# Altium schematic sheet MainBoard.SchDoc
size A4
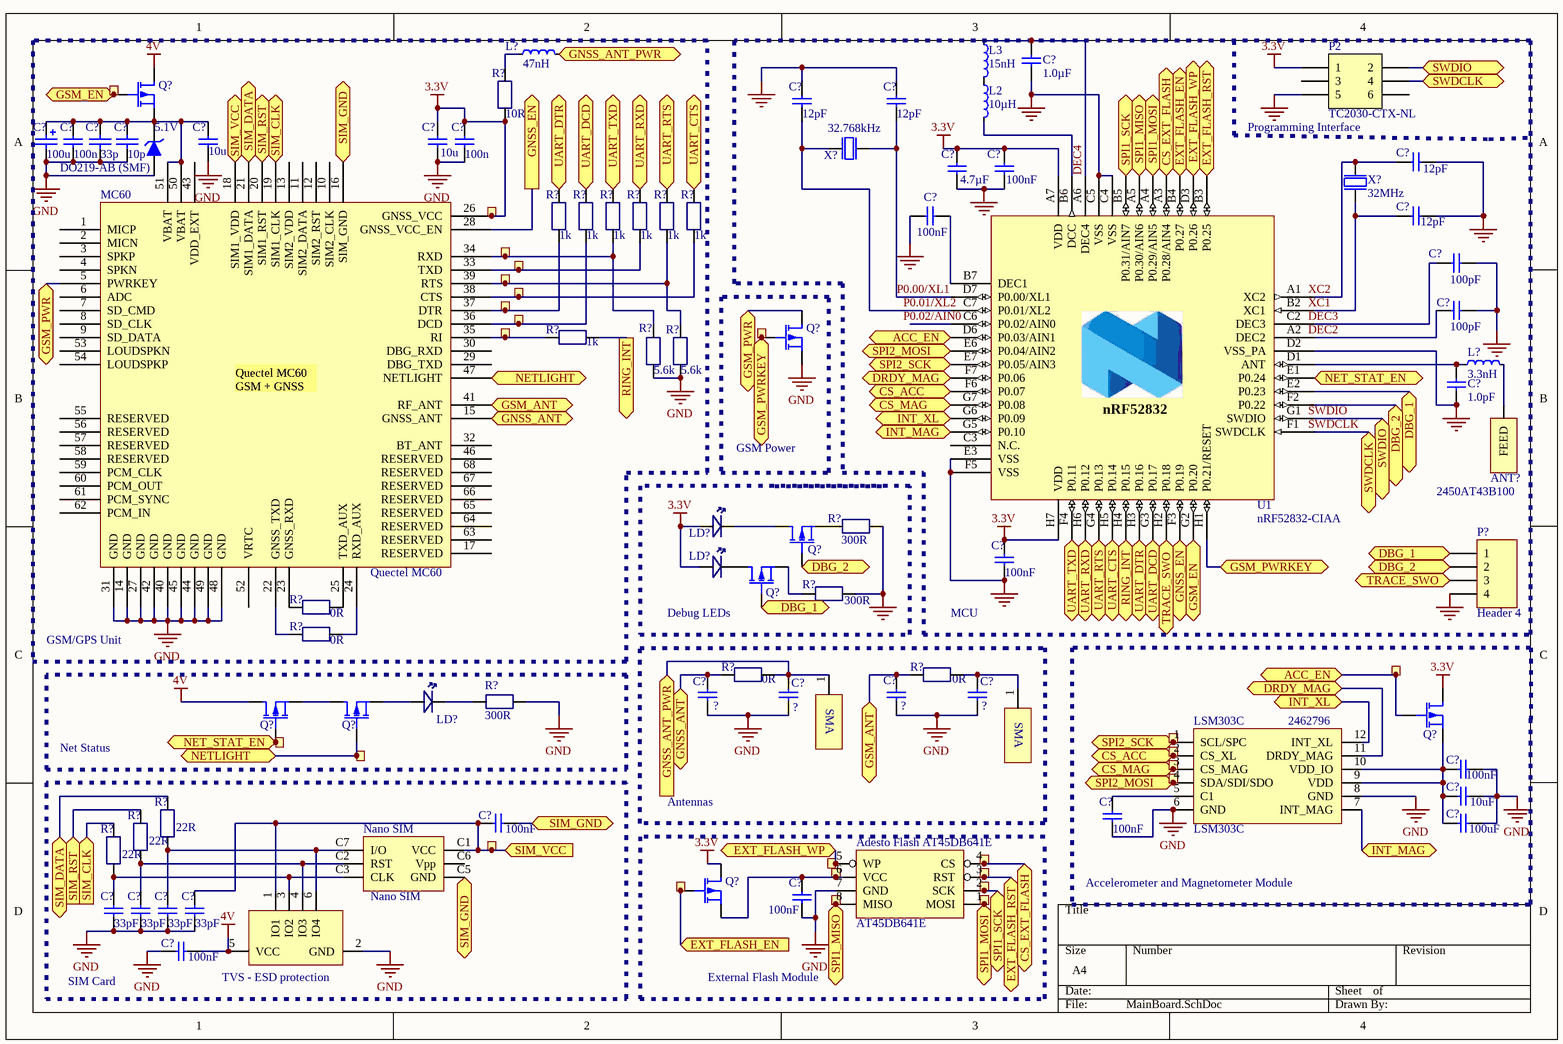
[diagram p0: MainBoard.SchDoc]

## Parts
(Parts that share a designator on the sheet are numbered #1, #2 ... from top to bottom, then left to right.)
5.1V  DO219-AB (SMF)  [DO219-AB]
?#1  Ø1.0mm,SMD  [TP_SMD_Ř1.0mm]  (value not drawn)  (no BOM)
?#2  Ø1.0mm,SMD  [TP_SMD_Ř1.0mm]  (value not drawn)  (no BOM)
?#3  Ø1.0mm,SMD  [TP_SMD_Ř1.0mm]  (value not drawn)  (no BOM)
?#4  Ø1.0mm,SMD  [TP_SMD_Ř1.0mm]  (value not drawn)  (no BOM)
?#5  Ø1.0mm,SMD  [TP_SMD_Ř1.0mm]  (value not drawn)  (no BOM)
?#6  Ø1.0mm,SMD  [TP_SMD_Ř1.0mm]  (value not drawn)  (no BOM)
?#7  Ø1.0mm,SMD  [TP_SMD_Ř1.0mm]  (value not drawn)  (no BOM)
?#8  Ø1.0mm,SMD  [TP_SMD_Ř1.0mm]  (value not drawn)  (no BOM)
?#9  Ø1.0mm,SMD  [TP_SMD_Ř1.0mm]  (value not drawn)  (no BOM)
?#10  Ø1.0mm,SMD  [TP_SMD_Ř1.0mm]  (value not drawn)  (no BOM)
?#11  Ø1.0mm,SMD  [TP_SMD_Ř1.0mm]  (value not drawn)  (no BOM)
?#12  Ø1.0mm,SMD  [TP_SMD_Ř1.0mm]  (value not drawn)  (no BOM)
?#13  Ø1.0mm,SMD  [TP_SMD_Ř1.0mm]  (value not drawn)  (no BOM)
?#14  Ø1.0mm,SMD  [TP_SMD_Ř1.0mm]  (value not drawn)  (no BOM)
?#15  Ø1.0mm,SMD  [TP_SMD_Ř1.0mm]  (value not drawn)  (no BOM)
?#16  Ø1.0mm,SMD  [TP_SMD_Ř1.0mm]  (value not drawn)  (no BOM)
?#17  Ø1.0mm,SMD  [TP_SMD_Ř1.0mm]  (value not drawn)  (no BOM)
?#18  Ø1.0mm,SMD  [TP_SMD_Ř1.0mm]  (value not drawn)  (no BOM)
?#19  Ø1.0mm,SMD  [TP_SMD_Ř1.0mm]  (value not drawn)  (no BOM)
?#20  Ø1.0mm,SMD  [TP_SMD_Ř1.0mm]  (value not drawn)  (no BOM)
?#21  Ø1.0mm,SMD  [TP_SMD_Ř1.0mm]  (value not drawn)  (no BOM)
?#22  Ø1.0mm,SMD  [TP_SMD_Ř1.0mm]  (value not drawn)  (no BOM)
?#23  Ø1.0mm,SMD  [TP_SMD_Ř1.0mm]  (value not drawn)  (no BOM)
?#24  Ø1.0mm,SMD  [TP_SMD_Ř1.0mm]  (value not drawn)  (no BOM)
?#25  Ø1.0mm,SMD  [TP_SMD_Ř1.0mm]  (value not drawn)  (no BOM)
?#26  Ø1.0mm,SMD  [TP_SMD_Ř1.0mm]  (value not drawn)  (no BOM)
?#27  TVS - ESD protection  [SO-G6/P.95]
Adesto_Flash_AT45DB641E  AT45DB641E  [UDFN 5x6mm 8pin]
ANT?  2450AT43B100  [2450AT43B100]
C?#1  1.0µF  [CAPC1005X04L]
C?#2  10u  [CAPC1608X06L]
C?#3  10u  [CAPC1608X06L]
C?#4  12pF  [CAPC0603X03L]
C?#5  12pF  [CAPC0603X03L]
C?#6  value 100u  [B]
C?#7  value 33p  [1608[0603]]
C?#8  value 10p  [1608[0603]]
C?#9  4.7µF  [CAPC1608X06L]
C?#10  100n  [CAPC1005X04L]
C?#11  100n  [CAPC1005X04L]
C?#12  12pF  [CAPC0603X03L]
C?#13  100nF  [CAPC1005X04L]
C?#14  100nF  [CAPC1005X04L]
C?#15  12pF  [CAPC0603X03L]
C?#16  100pF  [CAPC0603X03L]
C?#17  100pF  [CAPC0603X03L]
C?#18  1.0pF  [CAPC0603X03L]
C?#19  100nF  [CAPC1005X04L]
C?#20  ?  [CAPC1005X04L]
C?#21  ?  [CAPC1005X04L]
C?#22  ?  [CAPC1005X04L]
C?#23  ?  [CAPC1005X04L]
C?#24  100nF  [CAPC1005X04L]
C?#25  10uF  [CAPC1005X04L]
C?#26  100nF  [CAPC1005X04L]
C?#27  100uF  [CAPC1005X04L]
C?#28  100nF  [CAPC1005X04L]
C?#29  33pF  [CAPC1005X04L]
C?#30  33pF  [CAPC1005X04L]
C?#31  33pF  [CAPC1005X04L]
C?#32  100nF  [CAPC1005X04L]
C?#33  33pF  [CAPC1005X04L]
C?#34  100nF  [CAPC1005X04L]
L2  10µH  [INDC1608X06L]
L3  15nH  [INDC1005X04L]
L?#1  47nH  [INDC1005X04L]
L?#2  3.3nH  [INDC0603X03L]
LD?#1  0603_LED  [LED_0603]  (value not drawn)
LD?#2  0603_LED  [LED_0603]  (value not drawn)
LD?#3  0603_LED  [LED_0603]  (value not drawn)
LSM303C  LSM303C  Supplier Part Number 1: 2462796  [LGA-12]
MC60  Quectel MC60  [Quactel MC60 Footprint]
Nano_SIM  Nano SIM  [NANO_Sim_Holder]
P2  TC2030-CTX-NL  [TC2030-IDC-NLFP]  (no BOM)
P?  Header 4  [HDR1X4]
Q?#1  RZE002P02TLTR-ND  [SOT-416]  (value not drawn)
Q?#2  RZE002P02TLTR-ND  [SOT-416]  (value not drawn)
Q?#3  RZE002P02TLTR-ND  [SOT-416]  (value not drawn)
Q?#4  RZE002P02TLTR-ND  [SOT-416]  (value not drawn)
Q?#5  RZE002P02TLTR-ND  [SOT-416]  (value not drawn)
Q?#6  RZE002P02TLTR-ND  [SOT-416]  (value not drawn)
Q?#7  RZE002P02TLTR-ND  [SOT-416]  (value not drawn)
Q?#8  RZE002P02TLTR-ND  [SOT-416]  (value not drawn)
R?#1  value 10R  [RES_0402]  (hidden comment: RES_0402_1k)
R?#2  value 1k  [RES_0402]  (hidden comment: RES_0402_1k)
R?#3  value 1k  [RES_0402]  (hidden comment: RES_0402_1k)
R?#4  value 1k  [RES_0402]  (hidden comment: RES_0402_1k)
R?#5  value 1k  [RES_0402]  (hidden comment: RES_0402_1k)
R?#6  value 1k  [RES_0402]  (hidden comment: RES_0402_1k)
R?#7  value 1k  [RES_0402]  (hidden comment: RES_0402_1k)
R?#8  value 1k  [RES_0402]  (hidden comment: RES_0402_1k)
R?#9  value 5.6k  [RES_0402]  (hidden comment: RES_0402_1k)
R?#10  value 5.6k  [RES_0402]  (hidden comment: RES_0402_1k)
R?#11  value 300R  [RES_0402]  (hidden comment: RES_0402_1k)
R?#12  value 300R  [RES_0402]  (hidden comment: RES_0402_1k)
R?#13  value 0R  [RES_0402]  (hidden comment: RES_0402_1k)
R?#14  value 0R  [RES_0402]  (hidden comment: RES_0402_1k)
R?#15  value 0R  [RES_0402]  (hidden comment: RES_0402_1k)
R?#16  value 0R  [RES_0402]  (hidden comment: RES_0402_1k)
R?#17  value 300R  [RES_0402]  (hidden comment: RES_0402_1k)
R?#18  value 22R  [RES_0402]  (hidden comment: RES_0402_1k)
R?#19  value 22R  [RES_0402]  (hidden comment: RES_0402_1k)
R?#20  value 22R  [RES_0402]  (hidden comment: RES_0402_1k)
SMA_connector#1  GNSS_SMA  [SMA_Footprint]  (value not drawn)
SMA_connector#2  GSM_SMA  [SMA_Footprint]  (value not drawn)
U1  nRF52832-CIAA  [BGA50C40P7X8_295X322X50]
X?#1  32.768kHz  [XTAL_2012]
X?#2  32MHz  [BT-XTAL_2016]

## Blocks framed on the sheet
GSM/GPS Unit: 5.1V ?#1-?#9 C?#2 C?#3 C?#6-C?#8 C?#10 C?#11 L?#1 MC60 Q?#1 R?#1-R?#10 R?#13 R?#14
GSM Power: ?#10 Q?#2
Debug LEDs: LD?#1 LD?#2 Q?#3 Q?#4 R?#11 R?#12
Net Status: ?#12 ?#14 LD?#3 Q?#5 Q?#6 R?#17
Antennas: C?#20-C?#23 R?#15 R?#16 SMA_connector#1 SMA_connector#2
SIM Card: ?#18 ?#27 C?#26 C?#29-C?#31 C?#33 C?#34 Nano_SIM R?#18-R?#20

## Ports
ACC_EN, CS_ACC, CS_EXT_FLASH, CS_MAG, DBG_1, DBG_1 (in), DBG_2, DBG_2 (in), DRDY_MAG, EXT_FLASH_EN (in), EXT_FLASH_RST, EXT_FLASH_WP, GNSS_ANT, GNSS_ANT_PWR (in), GNSS_ANT_PWR (out), GNSS_EN (in), GNSS_EN (out), GSM_ANT, GSM_EN (in), GSM_EN (out), GSM_PWR, GSM_PWRKEY, INT_MAG, INT_XL, NET_STAT_EN, NETLIGHT, RING_INT (in), RING_INT (out), SIM_CLK (in), SIM_DATA, SIM_GND, SIM_RST (in), SIM_VCC (in), SPI1_MISO, SPI1_MOSI, SPI1_SCK, SPI2_MOSI, SPI2_SCK, SWDCLK, SWDIO, TRACE_SWO, UART_CTS, UART_DCD (in), UART_DTR (in), UART_RTS, UART_RXD (in), UART_RXD (out), UART_TXD (in), UART_TXD (out)

## Nets
3.3V: ?#2.1 C?#3.1 C?#9.1 C?#11.2 C?#13.2 C?#19.2 LD?#1.1(A) LD?#2.1(A) MC60.26(GNSS_VCC) P2.1 Q?#7.3 Q?#8.3 R?#1.2 U1.A7(VDD) U1.H7(VDD)
4V: ?#27.5(VCC) C?#34.2 Q?#1.3 Q?#5.3
GND: 5.1V.1(A) ?#27.2(GND) Adesto_Flash_AT45DB641E.7(GND) C?#1.1 C?#2.2 C?#3.2 C?#4.2 C?#5.2 C?#6.2 C?#7.1 C?#8.1 C?#9.2 C?#10.1 C?#11.1 C?#12.1 C?#13.1 C?#14.2 C?#15.1 C?#16.2 C?#17.1 C?#18.1 C?#19.1 C?#20.2 C?#21.2 C?#22.2 C?#23.2 C?#24.2 C?#25.1 C?#27.1 C?#28.1 C?#29.2 C?#30.2 C?#31.2 C?#32.1 C?#33.1 C?#34.1 LSM303C.6(GND) LSM303C.8(GND) MC60.14(GND) MC60.27(GND) MC60.31(GND) MC60.40(GND) MC60.42(GND) MC60.44(GND) MC60.45(GND) MC60.48(GND) MC60.49(GND) P2.5 P?.4 Q?#2.2 R?#9.1 R?#10.1 R?#11.1 R?#12.1 R?#17.1 U1.C4(VSS) U1.C5(VSS) U1.D2(VSS_PA) U1.E3(VSS) U1.F5(VSS) X?#2.2(GND) X?#2.4(GND)
ACC_EN: ?#11.1 Q?#7.1 U1.D6(P0.03/AIN1) ; port ACC_EN
CS_ACC: ?#15.1 LSM303C.2(CS_XL) U1.F6(P0.07) ; port CS_ACC
CS_EXT_FLASH: ?#20.1 Adesto_Flash_AT45DB641E.4(CS) U1.A3(P0.28/AIN4) ; port CS_EXT_FLASH
CS_MAG: ?#16.1 LSM303C.3(CS_MAG) U1.G7(P0.08) ; port CS_MAG
DBG_1: P?.1 Q?#4.1 U1.E2(P0.23) ; port DBG_1
DBG_2: P?.2 Q?#3.1 U1.F2(P0.22) ; port DBG_2
DEC4: C?#1.2 L3.1 U1.A6(DEC4)
DRDY_MAG: LSM303C.11(DRDY_MAG) U1.F7(P0.06) ; port DRDY_MAG
EXT_FLASH_EN: ?#23.1 Q?#8.1 U1.B4(P0.27) ; port EXT_FLASH_EN
EXT_FLASH_RST: ?#22.1 Adesto_Flash_AT45DB641E.3(RST) U1.B3(P0.25) ; port EXT_FLASH_RST
EXT_FLASH_WP: ?#19.1 Adesto_Flash_AT45DB641E.5(WP) U1.D3(P0.26) ; port EXT_FLASH_WP
GNSS_ANT: C?#20.1 MC60.15(GNSS_ANT) R?#15.1 ; port GNSS_ANT
GNSS_ANT_PWR: C?#21.1 L?#1.2 R?#15.2 SMA_connector#1.1 ; port GNSS_ANT_PWR
GNSS_EN: MC60.28(GNSS_VCC_EN) U1.F3(P0.19) ; port GNSS_EN
GSM_ANT: C?#22.1 MC60.41(RF_ANT) R?#16.2 ; port GSM_ANT
GSM_EN: ?#1.1 Q?#1.1 U1.G2(P0.20) ; port GSM_EN
GSM_PWR: MC60.5(PWRKEY) Q?#2.3 ; port GSM_PWR
GSM_PWRKEY: ?#10.1 Q?#2.1 U1.H1(P0.21/RESET) ; port GSM_PWRKEY
INT_MAG: LSM303C.7(INT_MAG) U1.G5(P0.10) ; port INT_MAG
INT_XL: LSM303C.12(INT_XL) U1.G6(P0.09) ; port INT_XL
NET_STAT_EN: ?#12.1 Q?#5.1 U1.E1(P0.24) ; port NET_STAT_EN
NETLIGHT: ?#14.1 MC60.47(NETLIGHT) Q?#6.1 ; port NETLIGHT
P0.00/XL1: C?#5.1 U1.D7(P0.00/XL1) X?#1.2(out)
P0.01/XL2: C?#4.1 U1.C7(P0.01/XL2) X?#1.1(inp)
RING_INT: R?#8.1 U1.H4(P0.15) ; port RING_INT
SIM_CLK: MC60.19(SIM1_CLK) R?#20.1 ; port SIM_CLK
SIM_DATA: MC60.21(SIM1_DATA) R?#18.1 ; port SIM_DATA
SIM_GND: C?#26.2 MC60.16(SIM_GND) Nano_SIM.C5(GND) ; port SIM_GND
SIM_RST: MC60.20(SIM1_RST) R?#19.1 ; port SIM_RST
SIM_VCC: ?#18.1 ?#27.1(IO1) C?#26.1 C?#31.1 MC60.18(SIM1_VDD) Nano_SIM.C1(VCC) ; port SIM_VCC
SPI1_MISO: ?#25.1 Adesto_Flash_AT45DB641E.8(MISO) U1.A5(P0.30/AIN6) ; port SPI1_MISO
SPI1_MOSI: ?#26.1 Adesto_Flash_AT45DB641E.1(MOSI) U1.A4(P0.29/AIN5) ; port SPI1_MOSI
SPI1_SCK: ?#24.1 Adesto_Flash_AT45DB641E.2(SCK) U1.B5(P0.31/AIN7) ; port SPI1_SCK
SPI2_MOSI: ?#17.1 LSM303C.4(SDA/SDI/SDO) U1.E6(P0.04/AIN2) ; port SPI2_MOSI
SPI2_SCK: ?#13.1 LSM303C.1(SCL/SPC) U1.E7(P0.05/AIN3) ; port SPI2_SCK
SWDCLK: P2.4 U1.F1(SWDCLK) ; port SWDCLK
SWDIO: P2.2 U1.G1(SWDIO) ; port SWDIO
TRACE_SWO: P?.3 U1.H2(P0.18) ; port TRACE_SWO
UART_CTS: R?#7.2 U1.H5(P0.14) ; port UART_CTS
UART_DCD: R?#3.1 U1.G3(P0.17) ; port UART_DCD
UART_DTR: R?#2.1 U1.H3(P0.16) ; port UART_DTR
UART_RTS: R?#6.2 U1.G4(P0.13) ; port UART_RTS
UART_RXD: R?#5.2 U1.H6(P0.12) ; port UART_RXD
UART_TXD: R?#4.2 U1.F4(P0.11) ; port UART_TXD
Net5.1V_2: 5.1V.2(K) C?#2.1 C?#6.1 C?#7.2 C?#8.2 C?#10.2 MC60.50(VBAT) MC60.51(VBAT) Q?#1.2
Net?#3_1: ?#3.1 MC60.34(RXD) R?#4.1 R?#9.2
Net?#4_1: ?#4.1 MC60.33(TXD) R?#5.1
Net?#5_1: ?#5.1 MC60.39(RTS) R?#6.1 R?#10.2
Net?#6_1: ?#6.1 MC60.38(CTS) R?#7.1
Net?#7_1: ?#7.1 MC60.37(DTR) R?#2.2
Net?#8_1: ?#8.1 MC60.36(DCD) R?#3.2
Net?#9_1: ?#9.1 MC60.35(RI) R?#8.2
Net?#21_1: ?#21.1 Adesto_Flash_AT45DB641E.6(VCC) C?#32.2 Q?#8.2
Net?#27_3: ?#27.3(IO2) C?#29.1 Nano_SIM.C3(CLK) R?#20.2
Net?#27_4: ?#27.4(IO3) C?#30.1 Nano_SIM.C2(RST) R?#19.2
Net?#27_6: ?#27.6(IO4) C?#33.2 Nano_SIM.C7(I/O) R?#18.2
NetANT?_1: ANT?.1(FEED) L?#2.2
NetC?#12_2: C?#12.2 U1.A1(XC2) X?#2.3(out)
NetC?#14_1: C?#14.1 U1.B7(DEC1)
NetC?#15_2: C?#15.2 U1.B2(XC1) X?#2.1(inp)
NetC?#16_1: C?#16.1 U1.C2(DEC3)
NetC?#17_2: C?#17.2 U1.A2(DEC2)
NetC?#18_2: C?#18.2 L?#2.1 U1.D1(ANT)
NetC?#23_1: C?#23.1 R?#16.1 SMA_connector#2.1
NetC?#24_1: C?#24.1 C?#25.2 C?#27.2 LSM303C.9(VDD) LSM303C.10(VDD_IO) Q?#7.2
NetC?#28_2: C?#28.2 LSM303C.5(C1)
NetL2_1: L2.1 L3.2
NetL2_2: L2.2 U1.B6(DCC)
NetL?#1_1: L?#1.1 R?#1.1
NetLD?#1_2: LD?#1.2(K) Q?#3.3
NetLD?#2_2: LD?#2.2(K) Q?#4.3
NetLD?#3_1: LD?#3.1(A) Q?#6.2
NetLD?#3_2: LD?#3.2(K) R?#17.2
NetMC60_22: MC60.22(GNSS_TXD) R?#14.1
NetMC60_23: MC60.23(GNSS_RXD) R?#13.1
NetMC60_24: MC60.24(RXD_AUX) R?#14.2
NetMC60_25: MC60.25(TXD_AUX) R?#13.2
NetQ?#3_2: Q?#3.2 R?#11.2
NetQ?#4_2: Q?#4.2 R?#12.2
NetQ?#5_2: Q?#5.2 Q?#6.3

Not connected (* = marked no-connect by the designer): MC60 1(MICP) 2(MICN) 3(SPKP) 4(SPKN) 6(ADC) 7(SD_CMD) 8(SD_CLK) 9(SD_DATA) 10(SIM2_CLK) 11(SIM2_DATA) 12(SIM2_RST) 13(SIM2_VDD) 17(RESERVED) 29(DBG_TXD) 30(DBG_RXD) 32(BT_ANT) 43(VDD_EXT) 46(RESERVED) 52(VRTC) 53(LOUDSPKN) 54(LOUDSPKP) 55(RESERVED) 56(RESERVED) 57(RESERVED) 58(RESERVED) 59(PCM_CLK) 60(PCM_OUT) 61(PCM_SYNC) 62(PCM_IN) 63(RESERVED) 64(RESERVED) 65(RESERVED) 66(RESERVED) 67(RESERVED) 68(RESERVED); Nano_SIM C6(Vpp); P2 3 6; U1 C3(N.C.) C6(P0.02/AIN0)

## Notes on the sheet
- Programming Interface
- MCU
- Accelerometer and Magnetometer Module
- External Flash Module
- Labels drawn without touching a wire or pin: DEC2, DEC3, P0.02/AIN0, SWDCLK, SWDIO, XC1, XC2
- (in symbol Component_1) SMA
- (in symbol nRF52832-CIAA) nRF52832
- (in symbol Quectel MC60) Quectel MC60 / GSM + GNSS /

## Library data of the parts
5.1V = Zener Diode: Supplier 1: Farnell; Supplier Part Number 1: 1703019
?#1-?#26 = TESTPAD: 1.0mm circular SMD testpad; Part Number: TP_SMD_Ø1.0MM; Manufacturer: Nordic Semiconductor; Artikkelnr Noca: N.A.; Manufacturer Part Number: *; Datasheet: *; Footprint: TP_SMD_Ø1.0mm; LatestRevisionDate: 2013-06-11; Pin Count: 1; Publisher: Nordic Semiconductor; Published: 2013-06-11; Value: Ø1.0mm,SMD; Note: *; Supplier: *; Supplier part number: *; 2nd source Supplier: *; 2nd source part number: *
?#27 = TPD4E001-DBV
C?#1 = C0402-1µ0: Capacitor, X5R, ±5%; Note: 6.3V; Artikkelnr Noca: 20039235; Artikkelnr Simpro: N.A.; Part Number: C0402-1µ0; Manufacturer: *; Manufacturer Part Number: *; Datasheet: *; LatestRevisionDate: 2009-11-23; Pin Count: 2; Publisher: Nordic Semiconductor; Published: 2009-05-08; Value: 1.0µF; Supplier: *; Supplier part number: *; 2nd source Supplier: *; 2nd source part number: *; Footprint Doc: 0402
C?#2 C?#3 = C0603-4µ7: Capacitor, X5R, ±10%; Value: 4.7µF; Note: 6.3V; Artikkelnr Noca: 20069060; Artikkelnr Simpro: N.A.; Part Number: C0603-4µ7; Manufacturer: *; Manufacturer Part Number: *; Datasheet: *; LatestRevisionDate: 2009-11-23; Pin Count: 2; Publisher: Nordic Semiconductor; Published: 2009-05-08; Supplier: *; Supplier part number: *; 2nd source Supplier: *; 2nd source part number: *; Footprint Doc: 0603
C?#4 C?#5 C?#12 C?#15 = C0201-12p: Capacitor, NP0, ±2%; Note: 50V; Artikkelnr Noca: N.A.; Part Number: C0201-12p; Manufacturer: *; Manufacturer Part Number: *; Datasheet: *; LatestRevisionDate: 2014-11-13; Pin Count: 2; Publisher: Nordic Semiconductor; Published: 2014-11-13; Value: 12pF; Supplier: *; Supplier part number: *; 2nd source Supplier: *; 2nd source part number: *; Footprint Doc: 0201; Artikkelnr Simpro: N.A.
C?#6 = CAP_B_100u: Solid Tantalum Capacitor; Supplier 1: Farnell; Supplier Part Number 1: 1658510
C?#7 C?#8 = Cap Semi: Capacitor (Semiconductor SIM Model); Published: 8-Jun-2000; LatestRevisionDate: 29-May-2009; LatestRevisionNote: IPC-7351 Footprint Added.; PackageReference: C1206; Publisher: Altium Limited; PackageDescription: Chip Capacitor; Supplier 1: Farnell
  C?#7: Supplier Part Number 1: 1907290
  C?#8: Supplier Part Number 1: 2309035
C?#9 = C0603-4µ7: Capacitor, X5R, ±10%; Note: 6.3V; Artikkelnr Noca: 20069060; Artikkelnr Simpro: N.A.; Part Number: C0603-4µ7; Manufacturer: *; Manufacturer Part Number: *; Datasheet: *; LatestRevisionDate: 2009-11-23; Pin Count: 2; Publisher: Nordic Semiconductor; Published: 2009-05-08; Value: 4.7µF; Supplier: *; Supplier part number: *; 2nd source Supplier: *; 2nd source part number: *; Footprint Doc: 0603
C?#10 C?#11 C?#13 C?#14 C?#19-C?#34 = CAP_0402: Capacitor, NP0, ±2%; Part Number: C0402-12p; Value: 12pF; Note: 50V; Artikkelnr Noca: 20029159; Artikkelnr Simpro: N.A.; Manufacturer: *; Manufacturer Part Number: *; Datasheet: *; LatestRevisionDate: 2011-05-11; Pin Count: 2; Publisher: Nordic Semiconductor; Published: 2009-05-08; Supplier: *; Supplier part number: *; 2nd source Supplier: *; 2nd source part number: *; Footprint Doc: 0402
  C?#25: Supplier 1: Farnell; Supplier Part Number 1: 2218854
C?#16 C?#17 = C0201-100p: Capacitor, NP0, ±5%; Note: Chip Cap 1%; Artikkelnr Noca: N.A.; Part Number: C0201-100p; Manufacturer: *; Manufacturer Part Number: *; Datasheet: *; LatestRevisionDate: 2014-11-13; Pin Count: 2; Publisher: Nordic Semiconductor; Published: 2014-11-13; Value: 100pF; Supplier: *; Supplier part number: *; 2nd source Supplier: *; 2nd source part number: *; Footprint Doc: 0201; Artikkelnr Simpro: N.A.
C?#18 = C0201-1.0p: Capacitor, NP0, ±5%; Note: Chip Cap 1%; Artikkelnr Noca: N.A.; Part Number: C0201-1.0p; Manufacturer: *; Manufacturer Part Number: *; Datasheet: *; LatestRevisionDate: 2014-11-13; Pin Count: 2; Publisher: Nordic Semiconductor; Published: 2014-11-13; Value: 1.0pF; Supplier: *; Supplier part number: *; 2nd source Supplier: *; 2nd source part number: *; Footprint Doc: 0201; Artikkelnr Simpro: N.A.
L2 = L0603-10µ: Chip inductor, IDC,min = 50 mA, ±20%; Manufacturer: Taiyo Yuden; Manufacturer Part Number: LBMF1608T100K; 2nd source part number: 178-6105; Note: LBMF1608T100K 10µH 80mA 0603; Artikkelnr Noca: 33029314; Artikkelnr Simpro: N.A.; Part Number: L0603-10µ; Datasheet: http://www.yuden.co.jp/ut/product/pdf/elb2_e.pdf; LatestRevisionDate: 2012-09-19; Pin Count: 2; Publisher: Nordic Semiconductor; Published: 2010-02-24; Value: 10µH; Supplier: Digi-Key; Supplier part number: 587-1714-1-ND; 2nd source Supplier: Farnell; Footprint Doc: 0603
L3 = L0402-15n: High frequency chip inductor ±10%; Manufacturer: Taiyo Yuden; Manufacturer Part Number: HK100515NJ-T; 2nd source part number: 658-1328; Artikkelnr Noca: 33029323; Artikkelnr Simpro: N.A.; Part Number: L0402-15n; LatestRevisionDate: 2012-09-19; Pin Count: 2; Publisher: Nordic Semiconductor; Published: 2010-07-12; Value: 15nH; Note: High frequency chip inductor ±10%; Supplier: Digi-Key; Datasheet: http://www.yuden.co.jp/productdata/catalog/en/mlci04_e.pdf; Supplier part number: 587-1521-1-ND; 2nd source Supplier: Farnell; Footprint Doc: 0402
L?#1 = L0402-15n: High frequency chip inductor ±10%; Supplier 1: Farnell; Supplier Part Number 1: 2285742
L?#2 = L0201-3n3: High frequency chip inductor ±5%; Artikkelnr Noca: N.A.; Part Number: L0201-3n3; Manufacturer: *; Manufacturer Part Number: *; Datasheet: *; LatestRevisionDate: 2013-04-10; Pin Count: 2; Publisher: Nordic Semiconductor; Published: 2013-04-10; Value: 3.3nH; Note: High frequency chip inductor ±5%; Supplier: *; Supplier part number: *; 2nd source Supplier: *; 2nd source part number: *; Footprint Doc: 0201; Artikkelnr Simpro: N.A.
LD?#1-LD?#3 = LED_0603_Blue: Supplier 1: Digi-Key; Supplier 2: TME; Supplier 3: TME; Supplier 4: TME; Supplier 5: TME; Supplier Part Number 1: 160-1647-2-ND; Supplier Part Number 2: LL-S192PBC-B4-1B; Supplier Part Number 3: LL-S194PBC-B4-1B; Supplier Part Number 4: OF-SMD1608B; Supplier Part Number 5: OSB50603C1D
P2 = TC2030-CTX-NL: CBL PLUG-OF-NAILS 6-PIN; Manufacturer: Tag-Connect LLC; Artikkelnr Noca: N.A.; Part Number: TC2030-CTX-NL; Manufacturer Part Number: TC2030-CTX-NL; Datasheet: http://www.tag-connect.com/Materials/TC2030-IDC-NL.pdf; LatestRevisionDate: 2013-08-08; Pin Count: 6; Publisher: Nordic Semiconductor; Published: 2013-08-08; Value: TC2030-CTX-NL; Supplier: Tag-Connect; Supplier part number: TC2030-CTX-NL; 2nd source Supplier: *; 2nd source part number: *
P? = Header 4: Header, 4-Pin; LatestRevisionDate: 17-Jul-2002; LatestRevisionNote: Re-released for DXP Platform.; Publisher: Altium Limited
SMA_connector#1 SMA_connector#2 = Component_1: Supplier 1: Farnell; Supplier Part Number 1: 4194615
U1 = nRF52832-CIAA: Multi-protocol Bluetooth Low Energy, ANT and 2.4GHz proprietary system-on-chip; Manufacturer: Nordic Semiconductor; Artikkelnr Noca: N.A.; Part Number: nRF52832-CIAA; Manufacturer Part Number: nRF52832-CIAA; Datasheet: *; LatestRevisionDate: 2016-03-11; Pin Count: 54; Publisher: Nordic Semiconductor; Published: 2016-03-11; Value: nRF52832-CIAA; Note: *; Supplier: Nordic Semiconductor; Supplier part number: *; 2nd source Supplier: *; 2nd source part number: *; Footprint Doc: WLCSP_C50; Artikkelnr Simpro: N.A.; Part number IPS: N.A.
X?#1 = XTAL_SMD2012_32.768kHz_9pF_Seiko: XTAL SMD 2012, 32.768kHz, Cl=9pF, Total Tol: ±50ppm; Manufacturer: Seiko; Manufacturer Part Number: SC20S-9.0PF20PPM; Note: XTAL SMD 32.768kHz, 2012; Artikkelnr Noca: N.A.; Part Number: XTAL_SMD2012_32.768kHz_9pF_Seiko; Datasheet: http://www.sii.co.jp/en/quartz/files/2013/03/file_PRODUCT_MASTER_50811_GRAPHIC03.pdf; LatestRevisionDate: 2015-10-15; Pin Count: 2; Publisher: Nordic Semiconductor; Published: 2015-10-15; Value: 32.768kHz; Supplier: *; Supplier part number: *; 2nd source Supplier: *; 2nd source part number: *; Footprint Doc: XTAL_2012; Artikkelnr Simpro: N.A.
X?#2 = XTAL_SMD2016_32MHz_8pF_Epson: XTAL SMD 2016, 32MHz, Cl=8pF, Total Tol: ±40ppm; Manufacturer: Epson Toyocom; Manufacturer Part Number: Q22FA12800025; Note: XTAL SMD 32.000MHz; Artikkelnr Noca: N.A.; Part Number: XTAL_SMD2016_32MHz_8pF_Epson; Datasheet: http://www.epsondevice.com/docs/qd/en/DownloadServlet?id=ID000449; LatestRevisionDate: 2014-11-27; Pin Count: 4; Publisher: Nordic Semiconductor; Published: 2012-03-09; Value: 32MHz; Supplier: Farnell; Supplier part number: 171-2806; 2nd source Supplier: *; 2nd source part number: *; Footprint Doc: XTAL_2016; Artikkelnr Simpro: N.A.
ANT? = 2450AT43B100: Supplier 1: Mouser; Supplier 2: Farnell; Supplier 3: Farnell; Supplier 4: Digi-Key; Supplier 5: Digi-Key; Supplier 6: Digi-Key; Supplier Part Number 1: 609-2450AT43B100E; Supplier Part Number 2: 2148524; Supplier Part Number 3: 2148524RL; Supplier Part Number 4: 712-1010-2-ND; Supplier Part Number 5: 712-1010-1-ND; Supplier Part Number 6: 712-1010-6-ND
LSM303C = LSM303C: Supplier 1: Farnell
Q?#1-Q?#8 = RZE002P02TLTR-ND: Supplier 1: Digi-Key; Supplier 2: Digi-Key; Supplier 3: Digi-Key; Supplier Part Number 1: RZE002P02TLTR-ND; Supplier Part Number 2: RZE002P02TLCT-ND; Supplier Part Number 3: RZE002P02TLDKR-ND; Value: RZE002P02TL
R?#1-R?#20 = RES_0402_1k: Supplier 1: Digi-Key; Supplier 2: Farnell; Supplier 3: Mouser; Supplier Part Number 1: 311-1.0KJRTR-ND; Supplier Part Number 2: 1358043; Supplier Part Number 3: 603-RC0402FR-071KL